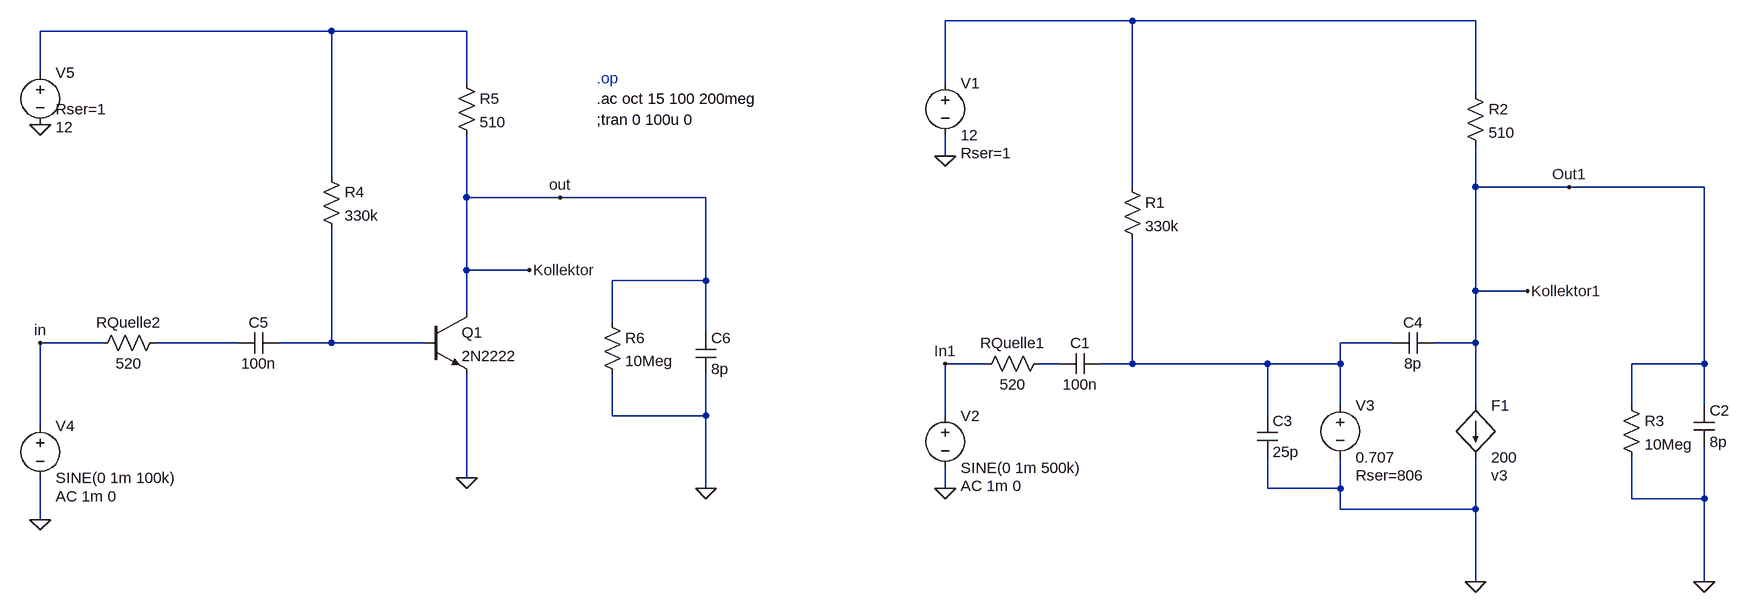
[diagram p0: schematic 1-5-5.asc]
1-5-5.asc, the LTspice schematic file:
Version 4.1
SHEET 1 1992 692
WIRE 960 -1152 672 -1152
WIRE 1488 -1152 960 -1152
WIRE -272 -1136 -720 -1136
WIRE -64 -1136 -272 -1136
WIRE -720 -1072 -720 -1136
WIRE -64 -1056 -64 -1136
WIRE 672 -1056 672 -1152
WIRE 1488 -1040 1488 -1152
WIRE 672 -944 672 -976
WIRE -272 -912 -272 -1136
WIRE 960 -896 960 -1152
WIRE 1488 -896 1488 -960
WIRE 1632 -896 1488 -896
WIRE 1840 -896 1632 -896
WIRE -64 -880 -64 -976
WIRE 80 -880 -64 -880
WIRE 304 -880 80 -880
WIRE -64 -768 -64 -880
WIRE 32 -768 -64 -768
WIRE 304 -752 304 -880
WIRE 304 -752 160 -752
WIRE 1488 -736 1488 -896
WIRE 1568 -736 1488 -736
WIRE -64 -704 -64 -768
WIRE 160 -688 160 -752
WIRE 304 -672 304 -752
WIRE -624 -656 -720 -656
WIRE -416 -656 -544 -656
WIRE -272 -656 -272 -832
WIRE -272 -656 -352 -656
WIRE -128 -656 -272 -656
WIRE 1360 -656 1280 -656
WIRE 1488 -656 1488 -736
WIRE 1488 -656 1424 -656
WIRE 736 -624 672 -624
WIRE 848 -624 816 -624
WIRE 960 -624 960 -816
WIRE 960 -624 912 -624
WIRE 1168 -624 960 -624
WIRE 1280 -624 1280 -656
WIRE 1280 -624 1168 -624
WIRE 1840 -624 1840 -896
WIRE 1840 -624 1728 -624
WIRE 1280 -560 1280 -624
WIRE 1488 -560 1488 -656
WIRE 1728 -560 1728 -624
WIRE 1840 -560 1840 -624
WIRE 160 -544 160 -608
WIRE 304 -544 304 -608
WIRE 304 -544 160 -544
WIRE 672 -544 672 -624
WIRE 1168 -544 1168 -624
WIRE -720 -528 -720 -656
WIRE -64 -448 -64 -608
WIRE 304 -432 304 -544
WIRE 672 -432 672 -464
WIRE 1168 -432 1168 -480
WIRE 1280 -432 1280 -480
WIRE 1280 -432 1168 -432
WIRE 1728 -416 1728 -480
WIRE 1840 -416 1840 -496
WIRE 1840 -416 1728 -416
WIRE 1280 -400 1280 -432
WIRE 1488 -400 1488 -480
WIRE 1488 -400 1280 -400
WIRE -720 -384 -720 -448
WIRE 1488 -288 1488 -400
WIRE 1840 -288 1840 -416
FLAG 672 -432 0
FLAG 672 -944 0
FLAG 1488 -288 0
FLAG 1840 -288 0
FLAG 672 -624 In1
FLAG 1568 -736 Kollektor1
FLAG 1632 -896 Out1
FLAG -720 -384 0
FLAG -720 -992 0
FLAG -64 -448 0
FLAG 304 -432 0
FLAG -720 -656 in
FLAG 80 -880 out
FLAG 32 -768 Kollektor
SYMBOL voltage 672 -1072 R0
WINDOW 123 0 0 Left 0
WINDOW 39 24 124 Left 2
SYMATTR SpiceLine Rser=1
SYMATTR InstName V1
SYMATTR Value 12
SYMBOL voltage 672 -560 R0
WINDOW 123 24 124 Left 2
WINDOW 39 0 0 Left 0
SYMATTR Value2 AC 1m 0
SYMATTR InstName V2
SYMATTR Value SINE(0 1m 500k)
SYMBOL voltage 1280 -576 R0
WINDOW 123 0 0 Left 0
WINDOW 39 24 124 Left 2
SYMATTR SpiceLine Rser=806
SYMATTR InstName V3
SYMATTR Value 0.707
SYMBOL f 1488 -560 R0
WINDOW 38 24 108 Left 2
SYMATTR SpiceModel v3
SYMATTR InstName F1
SYMATTR Value 200
SYMBOL cap 912 -640 R90
WINDOW 0 0 32 VBottom 2
WINDOW 3 32 32 VTop 2
SYMATTR InstName C1
SYMATTR Value 100n
SYMBOL res 944 -912 R0
SYMATTR InstName R1
SYMATTR Value 330k
SYMBOL res 1472 -1056 R0
SYMATTR InstName R2
SYMATTR Value 510
SYMBOL res 1712 -576 R0
SYMATTR InstName R3
SYMATTR Value 10Meg
SYMBOL cap 1824 -560 R0
SYMATTR InstName C2
SYMATTR Value 8p
SYMBOL cap 1152 -544 R0
SYMATTR InstName C3
SYMATTR Value 25p
SYMBOL cap 1424 -672 R90
WINDOW 0 0 32 VBottom 2
WINDOW 3 32 32 VTop 2
SYMATTR InstName C4
SYMATTR Value 8p
SYMBOL res 832 -640 R90
WINDOW 0 0 56 VBottom 2
WINDOW 3 32 56 VTop 2
SYMATTR InstName RQuelle1
SYMATTR Value 520
SYMBOL voltage -720 -544 R0
WINDOW 123 24 124 Left 2
WINDOW 39 0 0 Left 0
SYMATTR Value2 AC 1m 0
SYMATTR InstName V4
SYMATTR Value SINE(0 1m 100k)
SYMBOL res -528 -672 R90
WINDOW 0 0 56 VBottom 2
WINDOW 3 32 56 VTop 2
SYMATTR InstName RQuelle2
SYMATTR Value 520
SYMBOL cap -352 -672 R90
WINDOW 0 0 32 VBottom 2
WINDOW 3 32 32 VTop 2
SYMATTR InstName C5
SYMATTR Value 100n
SYMBOL res -288 -928 R0
SYMATTR InstName R4
SYMATTR Value 330k
SYMBOL res -80 -1072 R0
SYMATTR InstName R5
SYMATTR Value 510
SYMBOL npn -128 -704 R0
SYMATTR InstName Q1
SYMATTR Value 2N2222
SYMBOL voltage -720 -1088 R0
WINDOW 3 24 100 Left 2
WINDOW 123 0 0 Left 0
WINDOW 39 24 72 Left 2
SYMATTR Value 12
SYMATTR SpiceLine Rser=1
SYMATTR InstName V5
SYMBOL res 144 -704 R0
SYMATTR InstName R6
SYMATTR Value 10Meg
SYMBOL cap 288 -672 R0
SYMATTR InstName C6
SYMATTR Value 8p
TEXT 136 -1064 Left 2 ;.op
TEXT 136 -1032 Left 2 !.ac oct 15 100 200meg
TEXT 136 -1000 Left 2 !;tran 0 100u 0

The netlist it stands for:
* 1-5-5.asc
V1 N001 0 12 Rser=1
V2 In1 0 SINE(0 1m 500k) AC 1m 0
V3 N005 0 0.707 Rser=806
F1 Out1 0 v3 200
C1 N005 N006 100n
R1 N001 N005 330k
R2 N001 Out1 510
R3 Out1 0 10Meg
C2 Out1 0 8p
C3 N005 0 25p
C4 Out1 N005 8p
RQuelle1 N006 In1 520
V4 in 0 SINE(0 1m 100k) AC 1m 0
RQuelle2 N003 in 520
C5 N004 N003 100n
R4 N002 N004 330k
R5 N002 Kollektor 510
Q1 Kollektor N004 0 0 2N2222
V5 N002 0 12 Rser=1
R6 Kollektor 0 10Meg
C6 Kollektor 0 8p
.model NPN NPN
.model PNP PNP
.lib standard.bjt
* .op
.ac oct 15 100 200meg
;tran 0 100u 0
.backanno
.end